# Altium schematic sheet STM32L412CBU6.SchDoc
size A3; SheetNumber: 6; SheetTotal: 7
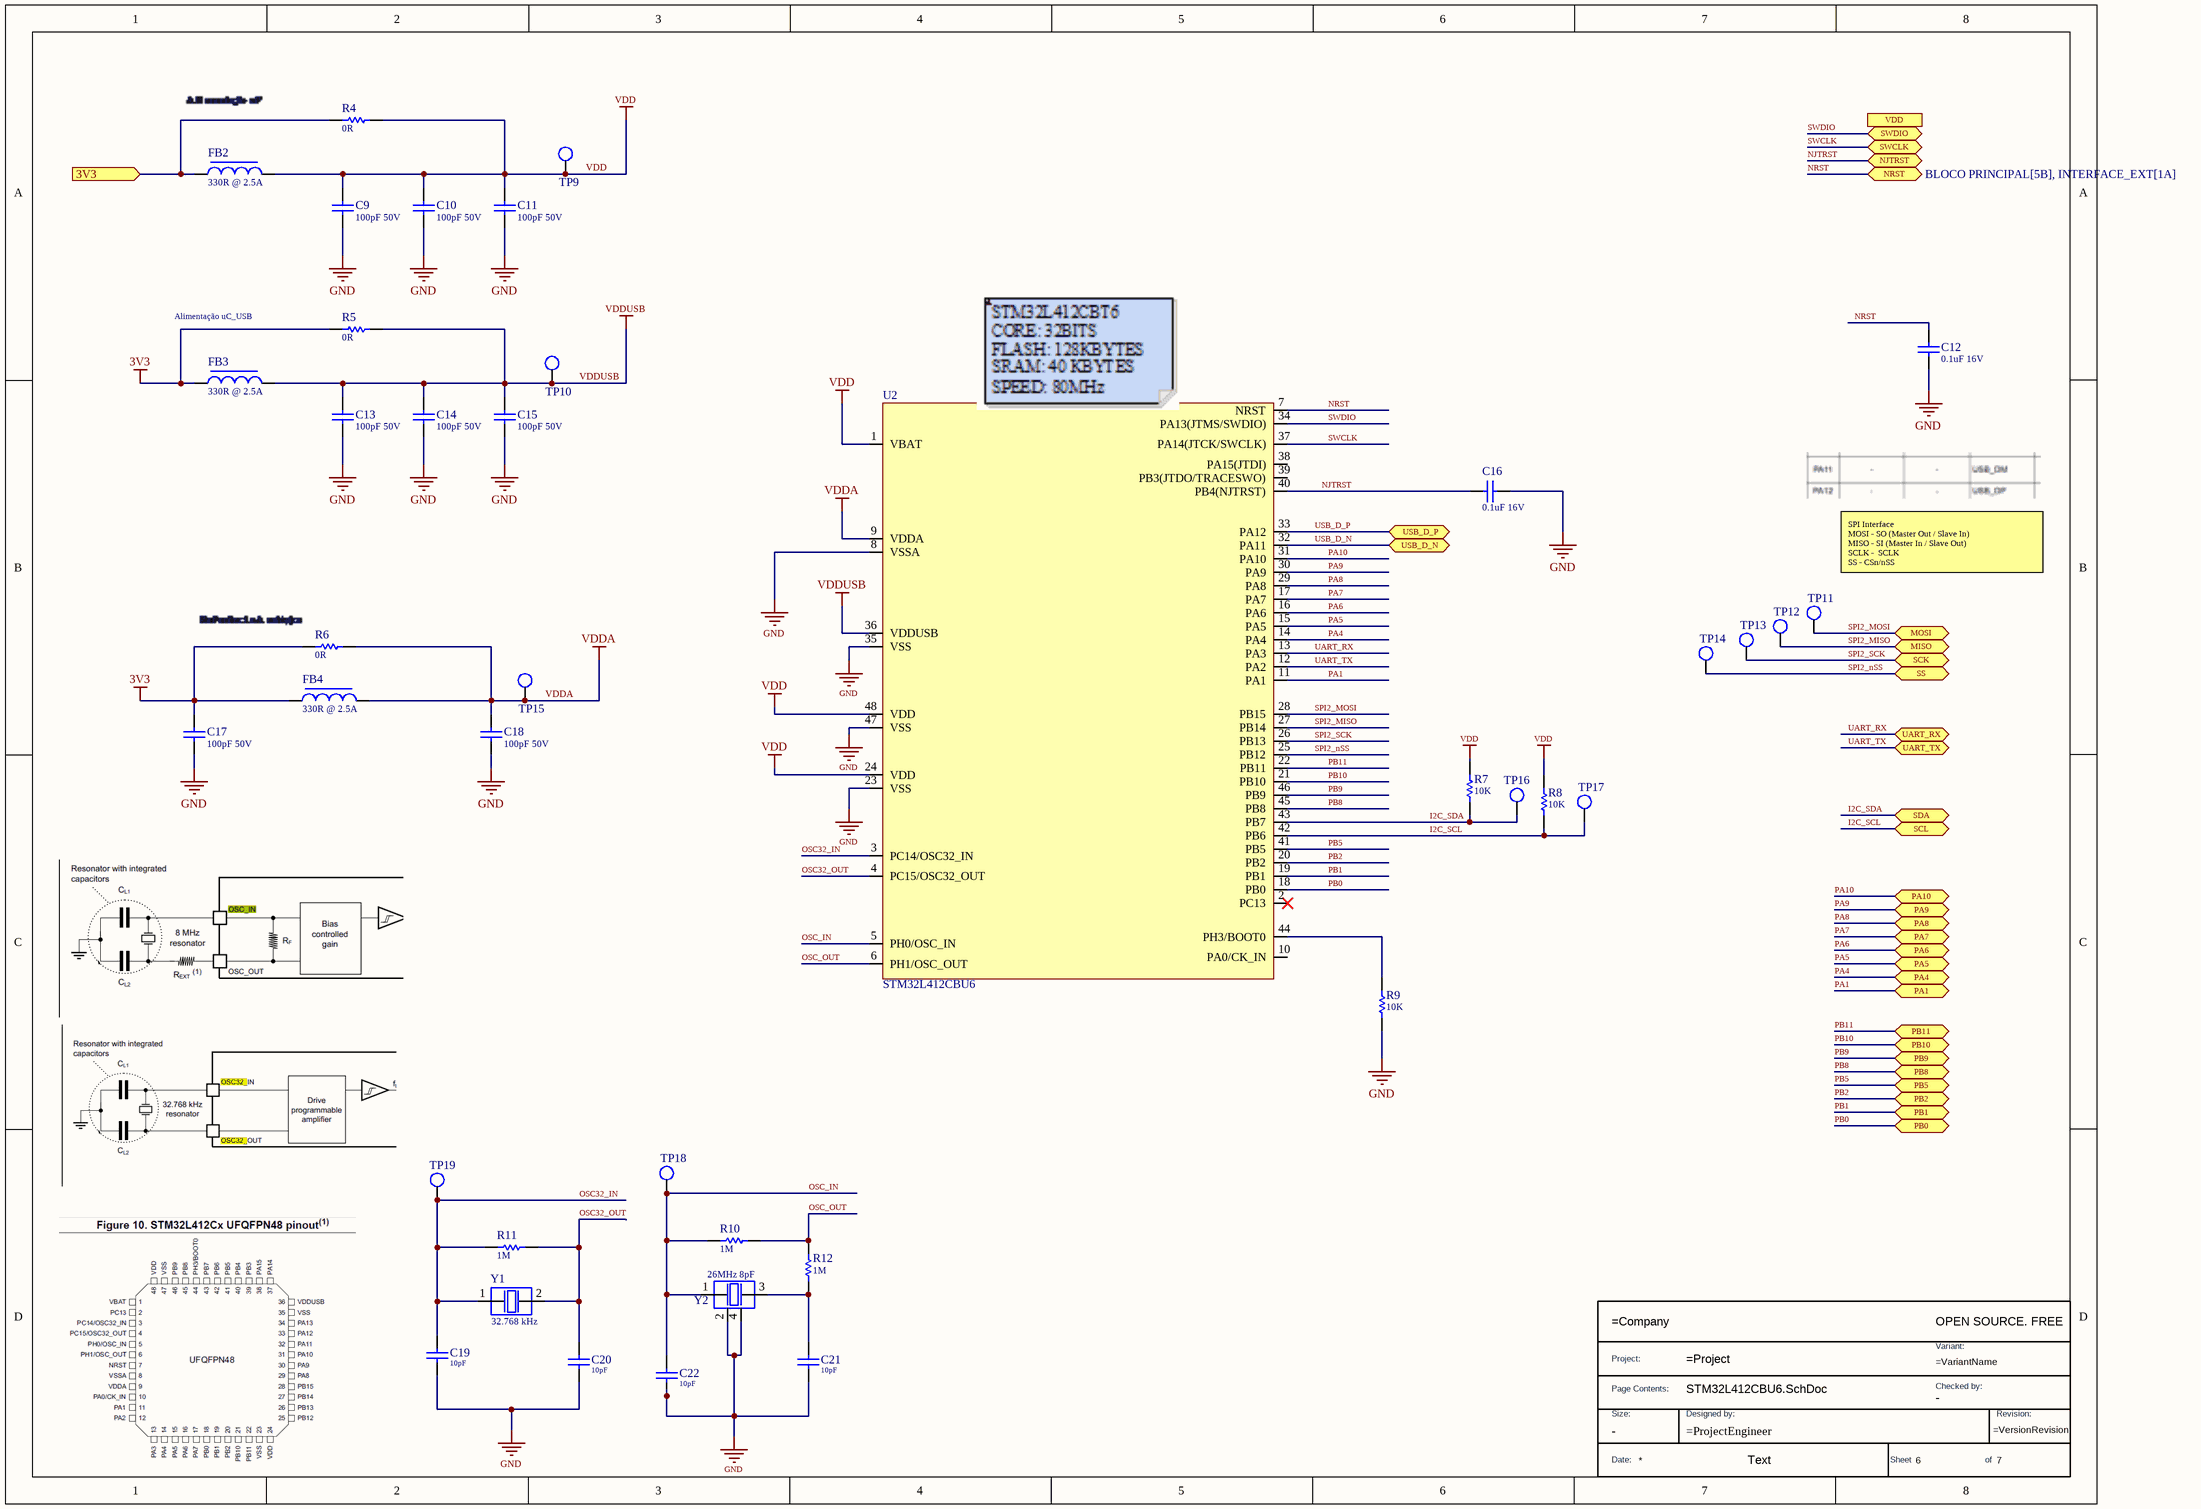
[diagram p0: STM32L412CBU6.SchDoc]

## Parts
*  TitleBlock  (value not drawn)  (graphical)
C9  Valor: 100pF 50V  [CAP_0805]  (hidden comment: CC0805JRNPO9BN101)
C10  Valor: 100pF 50V  [CAP_0805]  (hidden comment: CC0805JRNPO9BN101)
C11  Valor: 100pF 50V  [CAP_0805]  (hidden comment: CC0805JRNPO9BN101)
C12  Valor: 0.1uF 16V  [CAP_0805]  (hidden comment: CL05B104KO5NNNC)
C13  Valor: 100pF 50V  [CAP_0805]  (hidden comment: CC0805JRNPO9BN101)
C14  Valor: 100pF 50V  [CAP_0805]  (hidden comment: CC0805JRNPO9BN101)
C15  Valor: 100pF 50V  [CAP_0805]  (hidden comment: CC0805JRNPO9BN101)
C16  Valor: 0.1uF 16V  [CAP_0805]  (hidden comment: CL05B104KO5NNNC)
C17  Valor: 100pF 50V  [CAP_0805]  (hidden comment: CC0805JRNPO9BN101)
C18  Valor: 100pF 50V  [CAP_0805]  (hidden comment: CC0805JRNPO9BN101)
C19  Valor: 10pF  [CAP 0402]  (hidden comment: GRM1555C1H100FA01D)
C20  Valor: 10pF  [CAP 0402]  (hidden comment: GRM1555C1H100FA01D)
C21  Valor: 10pF  [CAP 0402]  (hidden comment: GRM1555C1H100FA01D)
C22  Valor: 10pF  [CAP 0402]  (hidden comment: GRM1555C1H100FA01D)
FB2  Valor: 330R @ 2.5A  [IND_0805]  (hidden comment: MPZ2012S331AT000)
FB3  Valor: 330R @ 2.5A  [IND_0805]  (hidden comment: MPZ2012S331AT000)
FB4  Valor: 330R @ 2.5A  [IND_0805]  (hidden comment: MPZ2012S331AT000)
R4  Valor: 0R  [RES_0805]  (hidden comment: RC0805JR-070RL)
R5  Valor: 0R  [RES_0805]  (hidden comment: RC0805JR-070RL)
R6  Valor: 0R  [RES_0805]  (hidden comment: RC0805JR-070RL)
R7  Valor: 10K  [RES_0805]  (hidden comment: AF0805JR-0710KL)
R8  Valor: 10K  [RES_0805]  (hidden comment: AF0805JR-0710KL)
R9  Valor: 10K  [RES_0805]  (hidden comment: AF0805JR-0710KL)
R10  Valor: 1M  [RES 0402]  (hidden comment: CRCW08051M00JNEA)
R11  Valor: 1M  [RES 0402]  (hidden comment: CRCW08051M00JNEA)
R12  Valor: 1M  [RES 0402]  (hidden comment: CRCW08051M00JNEA)
TP9  TEST_POINT_1.5MM  [TESTPOINT_1.5MM]  (value not drawn)  (no BOM)
TP10  TEST_POINT_1.5MM  [TESTPOINT_1.5MM]  (value not drawn)  (no BOM)
TP11  TEST_POINT_1.5MM  [TESTPOINT_1.5MM]  (value not drawn)  (no BOM)
TP12  TEST_POINT_1.5MM  [TESTPOINT_1.5MM]  (value not drawn)  (no BOM)
TP13  TEST_POINT_1.5MM  [TESTPOINT_1.5MM]  (value not drawn)  (no BOM)
TP14  TEST_POINT_1.5MM  [TESTPOINT_1.5MM]  (value not drawn)  (no BOM)
TP15  TEST_POINT_1.5MM  [TESTPOINT_1.5MM]  (value not drawn)  (no BOM)
TP16  TEST_POINT_1.5MM  [TESTPOINT_1.5MM]  (value not drawn)  (no BOM)
TP17  TEST_POINT_1.5MM  [TESTPOINT_1.5MM]  (value not drawn)  (no BOM)
TP18  TEST_POINT_1.5MM  [TESTPOINT_1.5MM]  (value not drawn)  (no BOM)
TP19  TEST_POINT_1.5MM  [TESTPOINT_1.5MM]  (value not drawn)  (no BOM)
U2  STM32L412CBU6  [QFN-48]
Y1  Valor: 32.768 kHz  [Crystal_32k]  (hidden comment: ABS07-32.768KHZ-7-T)
Y2  Valor: 26MHz 8pF  [Crystal-4SMD]  (hidden comment: NX3225SA-26MHZ)

## Ports
3V3 (in, see BLOCO PRINCIPAL[4B], CC1101RGPR[1A], INTERFACE_EXT[1B], LSM6DSOTR[1A], ST1S40IDR[8B]), MISO (bidir, see BLOCO PRINCIPAL[5D], CC1101RGPR[1B]), MOSI (bidir, see BLOCO PRINCIPAL[5D], CC1101RGPR[1B]), NJTRST (bidir, see BLOCO PRINCIPAL[5B], INTERFACE_EXT[1A]), NRST (bidir, see BLOCO PRINCIPAL[5B], INTERFACE_EXT[1A]), PA1 (bidir, see BLOCO PRINCIPAL[5C], INTERFACE_EXT[5A]), PA4 (bidir, see BLOCO PRINCIPAL[5C], INTERFACE_EXT[5A]), PA5 (bidir, see BLOCO PRINCIPAL[5C], INTERFACE_EXT[5A]), PA6 (bidir, see BLOCO PRINCIPAL[5C], INTERFACE_EXT[5A]), PA7 (bidir, see BLOCO PRINCIPAL[5C], INTERFACE_EXT[5A]), PA8 (bidir, see BLOCO PRINCIPAL[5C], INTERFACE_EXT[5A]), PA9 (bidir, see BLOCO PRINCIPAL[5C], INTERFACE_EXT[5A]), PA10 (bidir, see BLOCO PRINCIPAL[5C], INTERFACE_EXT[5A]), PB0 (bidir, see BLOCO PRINCIPAL[5C], INTERFACE_EXT[5B]), PB1 (bidir, see BLOCO PRINCIPAL[5C], INTERFACE_EXT[5B]), PB2 (bidir, see BLOCO PRINCIPAL[5C], INTERFACE_EXT[5B]), PB5 (bidir, see BLOCO PRINCIPAL[5C], INTERFACE_EXT[5B]), PB8 (bidir, see BLOCO PRINCIPAL[5C], INTERFACE_EXT[5B]), PB9 (bidir, see BLOCO PRINCIPAL[5C], INTERFACE_EXT[5B]), PB10 (bidir, see BLOCO PRINCIPAL[5C], INTERFACE_EXT[5B]), PB11 (bidir, see BLOCO PRINCIPAL[5C], INTERFACE_EXT[5B]), SCK (bidir, see BLOCO PRINCIPAL[5D], CC1101RGPR[1B]), SCL (bidir, see BLOCO PRINCIPAL[5B], LSM6DSOTR[7A]), SDA (bidir, see BLOCO PRINCIPAL[5B], LSM6DSOTR[7A]), SS (bidir, see BLOCO PRINCIPAL[5D], CC1101RGPR[1B]), SWCLK (bidir, see BLOCO PRINCIPAL[5B], INTERFACE_EXT[1A]), SWDIO (bidir, see BLOCO PRINCIPAL[5B], INTERFACE_EXT[1A]), UART_RX (bidir, see BLOCO PRINCIPAL[5C], INTERFACE_EXT[1B]), UART_TX (bidir, see BLOCO PRINCIPAL[5C], INTERFACE_EXT[1B]), USB_D_N (bidir, see BLOCO PRINCIPAL[4B], INTERFACE_EXT[1B], KH-TYPE-C-16P[5C], KH-TYPE-C-16P[8B]), USB_D_P (bidir, see BLOCO PRINCIPAL[4B], INTERFACE_EXT[1B], KH-TYPE-C-16P[5C], KH-TYPE-C-16P[8B]), VDD (out, see BLOCO PRINCIPAL[5B], INTERFACE_EXT[1A])

## Nets
3V3: C17.2 FB3.1 FB4.1 R5.1 R6.1
GND: C9.1 C10.1 C11.1 C12.1 C13.1 C14.1 C15.1 C16.2 C17.1 C18.1 C19.1 C20.1 C21.1 C22.1 R9.1 U2.8(VSSA) U2.23(VSS) U2.35(VSS) U2.47(VSS) Y2.2 Y2.4
VDD: C9.2 C10.2 C11.2 FB2.2 R4.2 R7.2 R8.2 TP9.1 U2.1(VBAT) U2.24(VDD) U2.48(VDD)
VDDA: C18.2 FB4.2 R6.2 TP15.1 U2.9(VDDA)
VDDUSB: C13.2 C14.2 C15.2 FB3.2 R5.2 TP10.1 U2.36(VDDUSB)
3V3: FB2.1 R4.1 ; port 3V3  [a separate net that carries the same name]
I2C_SCL: R8.1 TP17.1 U2.42(PB6) ; port SCL
I2C_SDA: R7.1 TP16.1 U2.43(PB7) ; port SDA
NJTRST: C16.1 U2.40(PB4(NJTRST)) ; port NJTRST
NRST: C12.2 U2.7(NRST) ; port NRST
OSC32_IN: C19.2 R11.1 TP19.1 U2.3(PC14/OSC32_IN) Y1.1
OSC32_OUT: C20.2 R11.2 U2.4(PC15/OSC32_OUT) Y1.2
OSC_IN: C22.2 R10.1 TP18.1 U2.5(PH0/OSC_IN) Y2.1
OSC_OUT: R10.2 R12.2 U2.6(PH1/OSC_OUT)
PA1: U2.11(PA1) ; port PA1
PA4: U2.14(PA4) ; port PA4
PA5: U2.15(PA5) ; port PA5
PA6: U2.16(PA6) ; port PA6
PA7: U2.17(PA7) ; port PA7
PA8: U2.29(PA8) ; port PA8
PA9: U2.30(PA9) ; port PA9
PA10: U2.31(PA10) ; port PA10
PB0: U2.18(PB0) ; port PB0
PB1: U2.19(PB1) ; port PB1
PB2: U2.20(PB2) ; port PB2
PB5: U2.41(PB5) ; port PB5
PB8: U2.45(PB8) ; port PB8
PB9: U2.46(PB9) ; port PB9
PB10: U2.21(PB10) ; port PB10
PB11: U2.22(PB11) ; port PB11
SPI2_MISO: TP12.1 U2.27(PB14) ; port MISO
SPI2_MOSI: TP11.1 U2.28(PB15) ; port MOSI
SPI2_nSS: TP14.1 U2.25(PB12) ; port SS
SPI2_SCK: TP13.1 U2.26(PB13) ; port SCK
SWCLK: U2.37(PA14(JTCK/SWCLK)) ; port SWCLK
SWDIO: U2.34(PA13(JTMS/SWDIO)) ; port SWDIO
UART_RX: U2.13(PA3) ; port UART_RX
UART_TX: U2.12(PA2) ; port UART_TX
USB_D_N: U2.32(PA11) ; port USB_D_N
USB_D_P: U2.33(PA12) ; port USB_D_P
NetC21_2: C21.2 R12.1 Y2.3
NetR9_2: R9.2 U2.44(PH3/BOOT0)

Not connected (* = marked no-connect by the designer): U2 2(PC13)* 10(PA0/CK_IN) 38(PA15(JTDI)) 39(PB3(JTDO/TRACESWO))

## Notes on the sheet
- Alimentação uC_USB
- SPI Interface
  MOSI - SO (Master Out / Slave In)
  MISO - SI (Master In / Slave Out)
  SCLK -  SCLK
  SS - CSn/nSS
- Todas as informações e detalhes técnicos deste documento são de inteira propriedade da empresa V2COM,
- não poderão ser copiados, reduzidos ou cedidos a terceiros sem prévia autorização por escrito da mesma.
- Salvo em (D/M/A):
- Página:
- de
- Nome do Projeto:
- https://v2com.com/
- Ed.:
- Responsável:
- Nome da página:
- Rev.:
- Projetista:
- Obs.:
- Revisor:
- Arquivo:
- -
- (in symbol TitleBlock) OPEN SOURCE. FREE; Project:; Variant:; Page Contents:; Checked by:; Size:; Designed by:; Revision:; Date:; Text; Sheet; of

## Library data of the parts
* = TitleBlock: Standard Title Block; DWG NO: =ProjectEngineer; Size: -; Checked by: -
C9-C11 C13-C15 C17 C18 = CC0805JRNPO9BN101: CAP CER 100PF 50V C0G/NPO 0805; Manufacturer: YAGEO; Origem: OBDH_Ed02; Case/Package: 0805; Manufacturer Part Number: CC0805JRNPO9BN101; Observação: *
C12 C16 = CL05B104KO5NNNC: CAP CER 0.1UF 16V X5R 0805; Manufacturer: Samsung Electro-Mechanics; Origem: OBDH_Ed02; Case/Package: 0805; Manufacturer Part Number: CL05B104KO5NNNC; Observação: *
C19-C22 = GRM1555C1H100FA01D: CAP CER 10PF 50V C0G/NP0 0402; Manufacturer: Murata Electronics; Case/Package: 0402; Manufacturer Part Number: GRM1555C1H100FA01D; Origem: *; Observação: *
FB2-FB4 = MPZ2012S331AT000: FERRITE BEAD 330 OHM 0805 1LN; Manufacturer: TDK Corporation; Case/Package: 0805; Manufacturer Part Number: MPZ2012S331AT000; Origem: *; Observação: *
R4-R6 = RC0805JR-070RL: RES 0 OHM JUMPER 1/8W 0805; Manufacturer: YAGEO; Case/Package: 0805; Manufacturer Part Number: RC0805JR-070RL; Origem: *; Observação: *
R7-R9 = AF0805JR-0710KL: RES SMD 10K OHM 5% 1/8W 0805; Manufacturer: YAGEO; Case/Package: 0805; Manufacturer Part Number: AF0805JR-0710KL; Origem: *; Observação: *
R10-R12 = CRCW08051M00JNEA: RES SMD 1M OHM 5% 1/8W 0805; Manufacturer: Vishay Intertech; Case/Package: 0805; Manufacturer Part Number: CRCW08051M00JNEA; Origem: *; Observação: *
TP9-TP19 = TEST_POINT_1.5MM: TEST_POINT; Origem: -; Case/Package: SMD; Manufacturer: -; Manufacturer Part Number: TEST_POINT; Observação: *; Valor: *
U2 = STM32L412CBU6: ARM® Cortex®-M4 STM32L4 Microcontroller IC 32-Bit Single-Core 80MHz 128KB (128K x 8) FLASH 48-LQFP (7x7)
Y1 = ABS07-32.768KHZ-7-T: CRYSTAL 32.7680KHZ 7PF SMD; Manufacturer: Abracon LLC; Manufacturer Part Number: ABS07-32.768KHZ-7-T; Case/Package: 2-SMD; Observação: *
Y2 = NX3225SA-26MHZ: CRYSTAL 26.0000MHZ 10PF SMD; Manufacturer: NDK America, Inc.; Manufacturer Part Number: NX3225SA-26MHZ; Observação: *